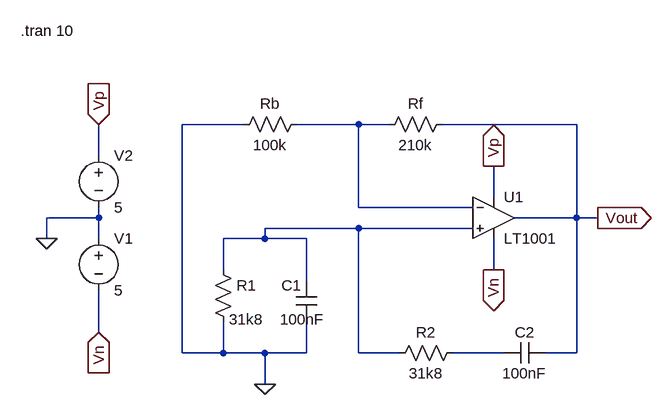
[diagram p0: schematic Wein-Bridge-Oscillator.asc]
Wein-Bridge-Oscillator.asc, the LTspice schematic file:
Version 4
SHEET 1 880 680
WIRE 32 -32 -64 -32
WIRE 208 -32 112 -32
WIRE 256 -32 208 -32
WIRE 544 -32 336 -32
WIRE -192 16 -192 -32
WIRE 416 80 416 32
WIRE 208 96 208 -32
WIRE 384 96 208 96
WIRE -192 112 -192 96
WIRE -192 112 -272 112
WIRE 544 112 544 -32
WIRE 544 112 448 112
WIRE 576 112 544 112
WIRE 208 128 64 128
WIRE 384 128 208 128
WIRE -272 144 -272 112
WIRE -192 144 -192 112
WIRE 64 144 64 128
WIRE 64 144 0 144
WIRE 128 144 64 144
WIRE 0 192 0 144
WIRE 416 192 416 144
WIRE 128 208 128 144
WIRE -192 288 -192 224
WIRE -64 320 -64 -32
WIRE 0 320 0 272
WIRE 0 320 -64 320
WIRE 64 320 0 320
WIRE 128 320 128 272
WIRE 128 320 64 320
WIRE 208 320 208 128
WIRE 272 320 208 320
WIRE 432 320 352 320
WIRE 544 320 544 112
WIRE 544 320 496 320
WIRE 64 368 64 320
FLAG -272 144 0
FLAG -192 -32 Vp
IOPIN -192 -32 In
FLAG -192 288 Vn
IOPIN -192 288 In
FLAG 64 368 0
FLAG 416 32 Vp
IOPIN 416 32 Out
FLAG 416 192 Vn
IOPIN 416 192 Out
FLAG 576 112 Vout
IOPIN 576 112 Out
SYMBOL voltage -192 128 R0
WINDOW 123 0 0 Left 0
WINDOW 39 0 0 Left 0
SYMATTR InstName V1
SYMATTR Value 5
SYMBOL voltage -192 0 R0
WINDOW 123 0 0 Left 0
WINDOW 39 0 0 Left 0
SYMATTR InstName V2
SYMATTR Value 5
SYMBOL OpAmps\\LT1001 416 48 R0
SYMATTR InstName U1
SYMBOL res 368 304 R90
WINDOW 0 0 56 VBottom 2
WINDOW 3 32 56 VTop 2
SYMATTR InstName R2
SYMATTR Value 31k8
SYMBOL cap 496 304 R90
WINDOW 0 0 32 VBottom 2
WINDOW 3 32 32 VTop 2
SYMATTR InstName C2
SYMATTR Value 100nF
SYMBOL cap 144 272 R180
WINDOW 0 24 56 Left 2
WINDOW 3 -12 4 Left 2
SYMATTR InstName C1
SYMATTR Value 100nF
SYMBOL res -16 176 R0
WINDOW 3 25 92 Left 2
SYMATTR InstName R1
SYMATTR Value 31k8
SYMBOL res 128 -48 R90
WINDOW 0 0 56 VBottom 2
WINDOW 3 32 56 VTop 2
SYMATTR InstName Rb
SYMATTR Value 100k
SYMBOL res 352 -48 R90
WINDOW 0 0 56 VBottom 2
WINDOW 3 32 56 VTop 2
SYMATTR InstName Rf
SYMATTR Value 210k
TEXT -312 -176 Left 2 !.tran 10

The netlist it stands for:
* Wein-Bridge-Oscillator.asc
V1 0 Vn 5
V2 Vp 0 5
XU1 N002 N001 Vp Vn Vout LT1001  ; pins In+ In- V+ V- OUT
R2 N003 N002 31k8
C2 Vout N003 100nF
C1 0 N002 100nF
R1 N002 0 31k8
Rb N001 0 100k
Rf Vout N001 210k
.tran 10
.lib LTC.lib
.backanno
.end